# EAGLE design NodeTemplate.cg2 (EAGLE 4.16)
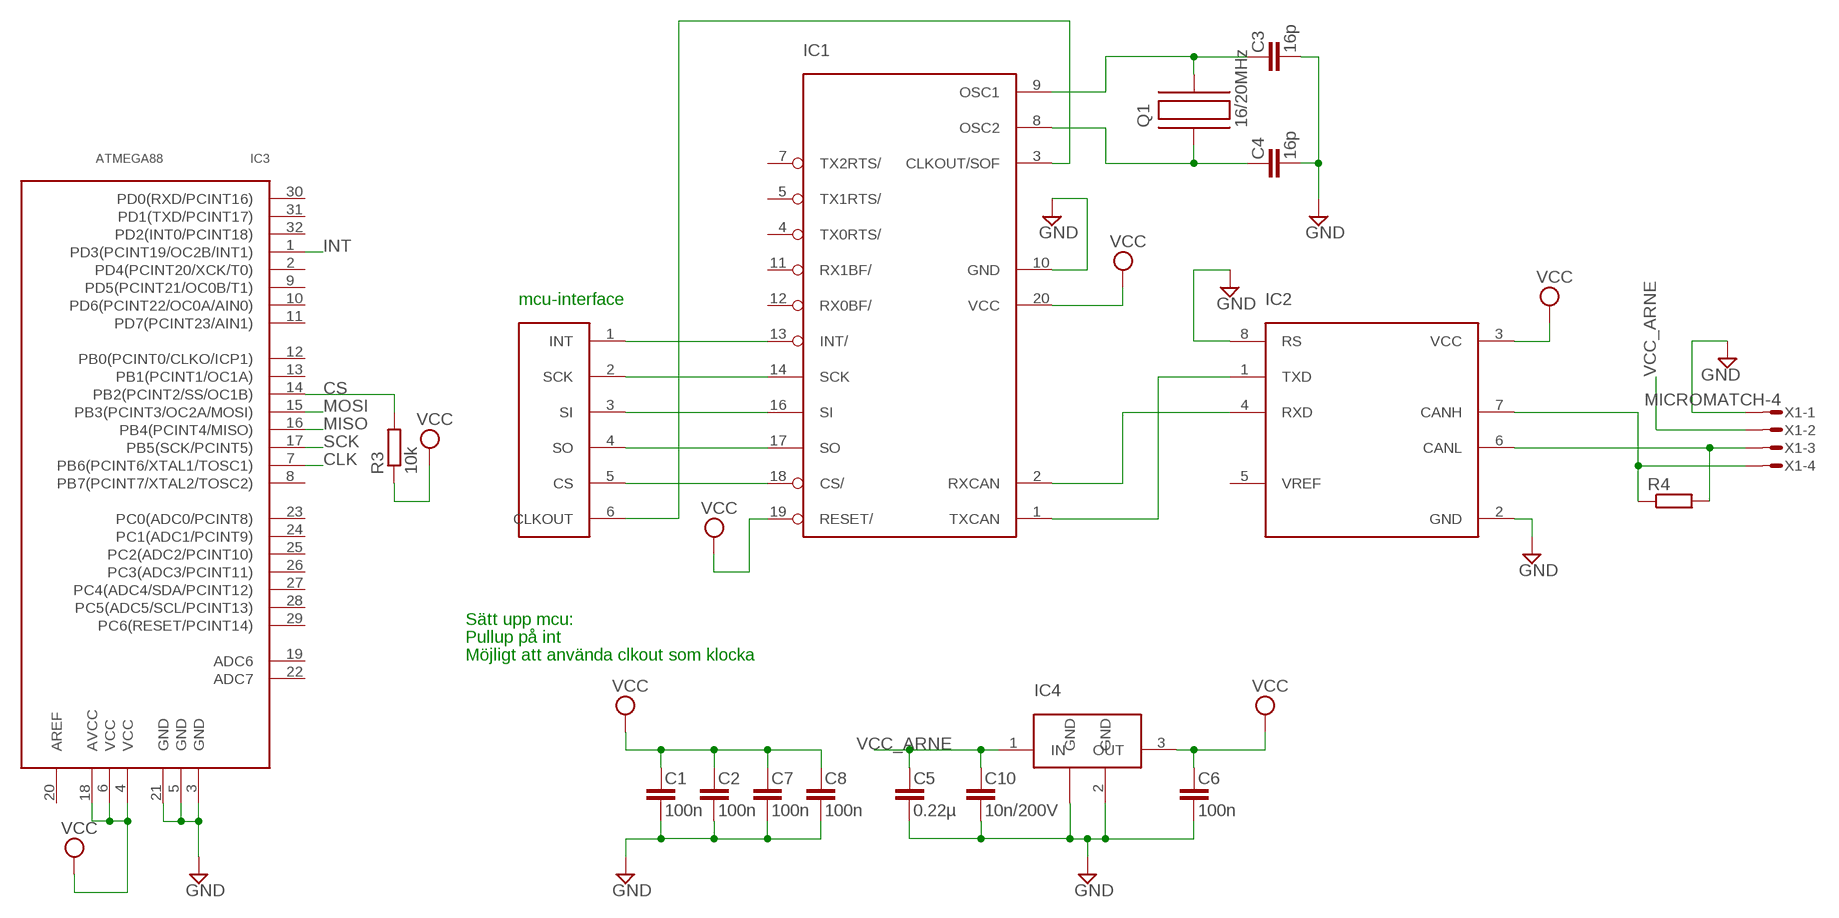
[diagram p0: schematic, sheet 1]

## Parts
C1  100n  C-EU  [C0603]
C2  100n  C-EU  [C0603]
C3  16p  C-EU  [C0603]
C4  16p  C-EU  [C0603]
C5  0.22µ  C-EU  [C0603]
C6  100n  C-EU  [C0603]
C7  100n  C-EU  [C0603]
C8  100n  C-EU  [C0603]
C10  10n/200V  C-EU  [C0603]
IC1  MCP2515  [TSSOP]
IC2  MCP2551  [SOIC]
IC3  ATMEGA88  [TQFP32]
IC4  LM340MP-5.0  [SOT223]
Q1  16/20MHz  C-MAC-LFA147E  [SMD]
R3  10k  R-EUR0603  [R0603]
R4  R-EUR0603  [R0603]
U$1  CAN-INTERFACE  [VIA-LIST]
X1  MICROMATCH-4  [MICROMATCH-4]

## Nets
CANH: IC2.7(CANH) R4.1 X1.4
CANL: IC2.6(CANL) R4.2 X1.3
CLK: IC1.3(CLKOUT/SOF) IC3.7(PB6(PCINT6/XTAL1/TOSC1)) U$1.6(CLKOUT)
CS: IC1.18(CS/) IC3.14(PB2(PCINT2/SS/OC1B)) R3.2 U$1.5(CS)
GND: C1.2 C2.2 C3.2 C4.2 C5.2 C6.2 C7.2 C8.2 C10.2 IC1.10(GND) IC2.2(GND) IC2.8(RS) IC3.3(GND) IC3.5(GND) IC3.21(GND) IC4.2(GND) IC4.4(GND) X1.1
INT: IC1.13(INT/) IC3.1(PD3(PCINT19/OC2B/INT1)) U$1.1(INT)
MISO: IC1.17(SO) IC3.16(PB4(PCINT4/MISO)) U$1.4(SO)
MOSI: IC1.16(SI) IC3.15(PB3(PCINT3/OC2A/MOSI)) U$1.3(SI)
N$1: IC1.2(RXCAN) IC2.4(RXD)
N$2: IC1.1(TXCAN) IC2.1(TXD)
N$12: C3.1 IC1.9(OSC1) Q1.P$2
N$13: C4.1 IC1.8(OSC2) Q1.P$1
SCK: IC1.14(SCK) IC3.17(PB5(SCK/PCINT5)) U$1.2(SCK)
VCC: C1.1 C2.1 C6.1 C7.1 C8.1 IC1.19(RESET/) IC1.20(VCC) IC2.3(VCC) IC3.4(VCC) IC3.6(VCC) IC3.18(AVCC) IC4.3(OUT) R3.1
VCC_ARNE: C5.1 C10.1 IC4.1(IN) X1.2
Unconnected: IC1.4(TX0RTS/) IC1.5(TX1RTS/) IC1.7(TX2RTS/) IC1.11(RX1BF/) IC1.12(RX0BF/) IC2.5(VREF) IC3.2(PD4(PCINT20/XCK/T0)) IC3.8(PB7(PCINT7/XTAL2/TOSC2)) IC3.9(PD5(PCINT21/OC0B/T1)) IC3.10(PD6(PCINT22/OC0A/AIN0)) IC3.11(PD7(PCINT23/AIN1)) IC3.12(PB0(PCINT0/CLKO/ICP1)) IC3.13(PB1(PCINT1/OC1A)) IC3.19(ADC6) IC3.20(AREF) IC3.22(ADC7) IC3.23(PC0(ADC0/PCINT8)) IC3.24(PC1(ADC1/PCINT9)) IC3.25(PC2(ADC2/PCINT10)) IC3.26(PC3(ADC3/PCINT11)) IC3.27(PC4(ADC4/SDA/PCINT12)) IC3.28(PC5(ADC5/SCL/PCINT13)) IC3.29(PC6(RESET/PCINT14)) IC3.30(PD0(RXD/PCINT16)) IC3.31(PD1(TXD/PCINT17)) IC3.32(PD2(INT0/PCINT18))

## Notes on the sheet
- mcu-interface
- Sätt upp mcu:
- Pullup på int
- Möjligt att använda clkout som klocka

## Library data of the parts
C1-C8 C10 = rcl:C-EU
IC1 = mcp2515:MCP2515
IC2 = mcp2551:MCP2551
IC3 = atmega88:ATMEGA88
IC4 = lm340mp:LM340MP-5.0
Q1 = hc49-4h-smx:C-MAC-LFA147E
R3 R4 = rcl:R-EU
U$1 = can-interface:CAN-INTERFACE
X1 = con-amp-micromatch:MICROMATCH-4: MicroMaTch 4 7-215464-4 / 0-215464-4 Drawing Number C-215464 DDEController.pdf

## Board
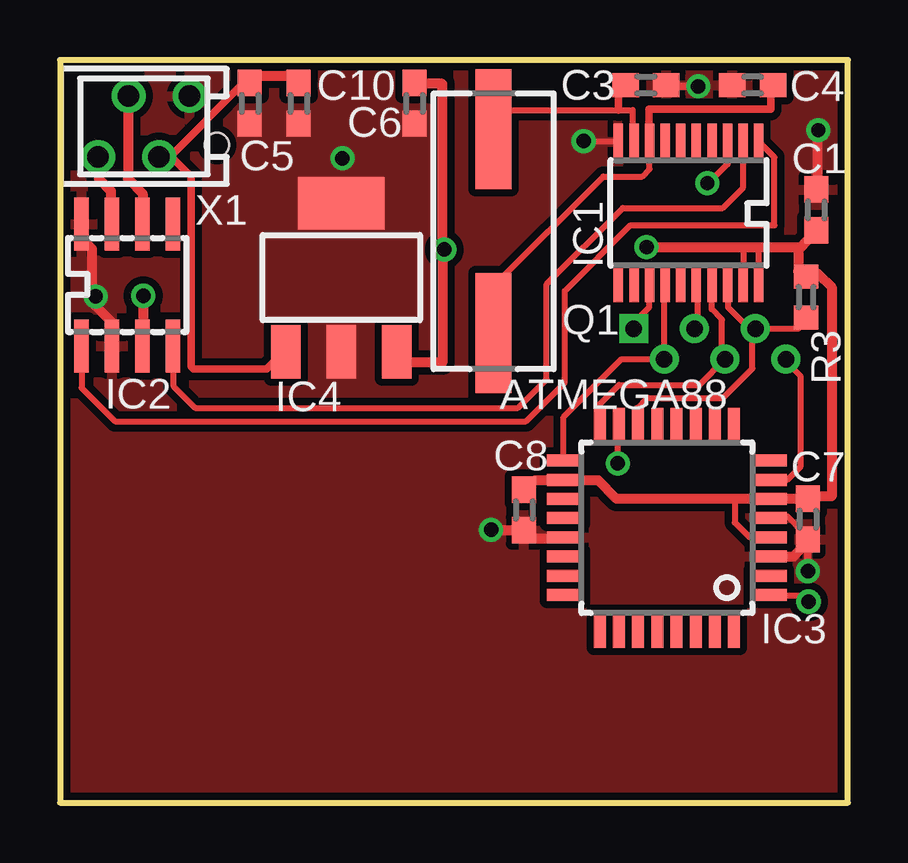
[diagram p1: board, top side]
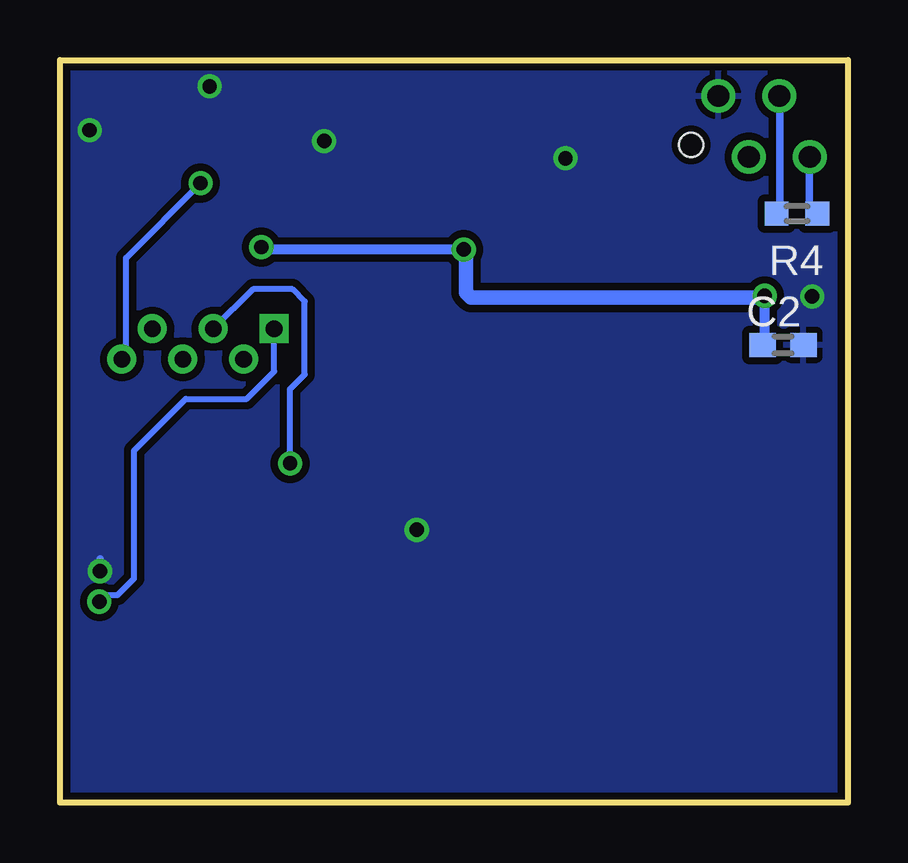
[diagram p2: board, bottom side, seen from below]

Size 32.85 x 30.97 mm. Coordinates in mm from the lower left corner, seen from the top.
Outline: 0,0 32.85,0 32.85,30.97 0,30.97 0,0
Copper layers (1*16): Top 0.035mm / dielectric 1.5mm / Bottom 0.035mm
Design rules "10mils, 0.6drill": minimum track width 10mil, minimum drill 0.6mm, track to track 10mil, track to pad 10mil, pad to pad 10mil, via to via 10mil, smd to smd 10mil, copper to edge 10mil, drill to drill 10mil, minimum pad ring 10mil, minimum via ring 8mil, stop-mask expansion 0mil, vias tented up to drill 0mil, thermal gap 10mil

### Footprints (pad centres in the part's own frame; a part is rotated, then mirrored left to right if it is on the bottom)
C0603 = smd 1.1 x 1: 1 -0.85,0; 2 0.85,0
TSSOP = smd 0.396 x 1.5: 1 -2.925,-2.975; 2 -2.275,-2.975; 3 -1.625,-2.975; 4 -0.975,-2.975; 5 -0.325,-2.975; 6 0.325,-2.975; 7 0.975,-2.975; 8 1.625,-2.975; 9 2.275,-2.975; 10 2.925,-2.975; 11 2.925,2.975; 12 2.275,2.975; 13 1.625,2.975; 14 0.975,2.975; 15 0.325,2.975; 16 -0.325,2.975; 17 -0.975,2.975; 18 -1.625,2.975; 19 -2.275,2.975; 20 -2.925,2.975
SOIC = smd 0.6 x 2.2: 1 -1.905,-2.54; 2 -0.635,-2.54; 3 0.635,-2.54; 4 1.905,-2.54; 5 1.905,2.54; 6 0.635,2.54; 7 -0.635,2.54; 8 -1.905,2.54
TQFP32 = smd 1.5 x 0.5: 1 -4.25,2.65; 2 -4.25,1.85; 3 -4.25,1.05; 4 -4.25,0.25; 5 -4.25,-0.55; 6 -4.25,-1.35; 7 -4.25,-2.15; 8 -4.25,-2.95; 17 4.25,-2.95; 18 4.25,-2.15; 19 4.25,-1.35; 20 4.25,-0.55; 21 4.25,0.25; 22 4.25,1.05; 23 4.25,1.85; 24 4.25,2.65 | smd 0.5 x 1.5: 9 -2.8,-4.4; 10 -2,-4.4; 11 -1.2,-4.4; 12 -0.4,-4.4; 13 0.4,-4.4; 14 1.2,-4.4; 15 2,-4.4; 16 2.8,-4.4; 25 2.8,4.1; 26 2,4.1; 27 1.2,4.1; 28 0.4,4.1; 29 -0.4,4.1; 30 -1.2,4.1; 31 -2,4.1; 32 -2.8,4.1
SOT223 = smd 1.219 x 2.235: 1 -2.311,-3.099; 2 0,-3.099; 3 2.311,-3.099 | smd 3.6 x 2.2: 4 0,3.099
SMD = smd 5 x 1.5: P$1 4.25,0; P$2 -4.25,0
R0603 = smd 0.991 x 1.016: 1 -0.85,0; 2 0.85,0
VIA-LIST = drill 0.7 square: 1 0,2.54 | drill 0.7 round: 2 -1.27,1.27; 3 0,0; 4 -1.27,-1.27; 5 0,-2.54; 6 -1.27,-3.81
MICROMATCH-4 = drill 0.9 round: 1 1.905,1.27; 2 0.635,-1.27; 3 -0.635,1.27; 4 -1.905,-1.27 | hole 1: 3.048,-0.762

### Placement (x,y rotation side)
C1  31.54,24.71 90 top
C2  2.7,19.09 0 bottom
C3  24.43,29.92 0 top
C4  28.87,29.92 180 top
C5  7.92,29.16 270 top
C6  14.77,29.16 270 top
C7  31.17,11.83 270 top
C8  19.34,12.21 270 top
C10  9.95,29.16 270 top
IC1  26.21,24.59 180 top
IC2  2.8,21.59 0 top
IC3  25.3,11.32 180 top
IC4  11.73,21.89 0 top
Q1  18.08,23.83 270 top
R3  31.11,21.08 270 top
R4  2.12,24.56 180 bottom
U$1  26.46,19.76 90 top
X1  3.5,28.19 0 top

### Tracks (layer width: path | path; a pad name or v marks a point on that pad's centre or on a via)
CANH
  Top 0.305: 2.12,24.17 IC2.7 | X1.4 1.62,26.92
  Top 0.406: 2.12,24.17 2.12,25.5 1.62,26.01 1.62,26.92
  Bottom 0.305: X1.4 1.62,26.92 1.62,24.91 R4.1
CANL
  Top 0.305: IC2.6 | X1.3 2.84,29.46
  Top 0.406: IC2.6 3.45,25.4 2.84,26.01 2.84,29.46
  Bottom 0.305: X1.3 2.84,29.46 2.84,24.7 R4.2
CLK  (via drill 0.6)
  Top 0.254: IC1.3 27.83,27.46 27.83,26.62 27.02,25.81 v26.99,25.83 | IC3.7 30.32,13.47 30.88,14.02 30.88,17.78 30.22,18.44 30.17,18.49
  Top 0.406: 30.17,18.39 30.22,18.44 U$1.6
  Bottom 0.254: v26.99,25.83 30.09,22.71 30.09,18.64 U$1.6
CS
  Top 0.254: IC1.18 27.83,21.74 27.86,21.74 27.86,20.65 28.87,19.63 | IC3.14 24.07,15.85 | 24.07,15.85 24.07,15.86 | 28.87,19.63 28.87,18.11 27.63,16.87 24.48,16.87 24.07,16.46 24.07,16.05 24.17,15.34 24.07,15.85 | 28.87,19.63 U$1.5 30.78,19.76 31.03,20.02 31.03,20.22 30.97,20.22 R3.2
GND  (via drill 0.6)
  Top 0.254: v21.84,27.59 23.28,27.59 IC1.10 | C1.2 31.59,25.88 | 1.34,20.85 v1.49,21.11 | 20.56,11.02 IC3.21 21.28,11.05 | C8.2 19.8,11.02 | C7.2 31.11,11.3 30.93,11.3 30.32,11.94 29.76,11.89 29.74,11.87 IC3.5 | v31.61,28.04 31.44,27.99 31.59,27.84
  Top 0.305: IC2.2 2.2,19.38 | C3.2 25.45,29.87 v26.61,29.87 | 30.93,11.3 31.16,11.3 31.18,11.28 31.18,10.77 v31.18,9.65
  Top 0.406: 2.2,19.38 2.2,19.99 1.34,20.85 1.34,23.09 0.83,23.6 IC2.8 | 19.8,11.02 20.56,11.02 | 31.59,25.88 31.59,27.84 | 31.18,10.77 31.08,10.77 30.58,10.27 IC3.3 | C8.2 18,11.36 v17.97,11.38
  Bottom 0.305: v26.61,29.87 26.56,29.95 | v31.18,9.65 31.18,10.16
  Bottom 0.406: v17.97,11.38 18.08,11.38
  other vias: 11.78,26.87
  pour Bottom (isolate 0.305): 0.12,30.86 32.83,30.86 32.83,0.1 24.38,0.1 0.12,0.1
  pour Top (isolate 0.305, no thermals): 5.83,30.5 15.89,30.5 15.89,16.78 5.83,16.78
  pour Top (isolate 0.305): 0.17,30.81 32.68,30.81 32.68,0.08 0.17,0.08
INT  (via drill 0.6)
  Top 0.254: IC1.13 | IC1.13 | U$1.1 23.92,20.02 24.55,20.65 24.55,21.59 IC1.13 | IC3.1 29.48,8.67 29.46,8.64 30.01,8.69 30.07,8.64 30.95,8.64 v31.21,8.38
  Bottom 0.254: v31.21,8.38 30.9,8.66 30.45,8.66 29.76,9.35 29.76,14.68 27.6,16.84 25.06,16.84 23.92,17.98 U$1.1
MISO
  Top 0.254: IC1.17 27.18,21.68 27.17,21.67 27.17,20.57 27.6,20.14 27.6,18.75 27.73,18.62 U$1.4 26.66,17.42 23.31,17.42 22.45,16.56 22.45,15.24 22.44,15.23 22.41,15.23 | IC3.16 22.41,15.23 | 22.41,15.23 22.39,15.3
MOSI  (via drill 0.6)
  Top 0.254: IC1.16 26.53,21.74 26.51,21.72 26.51,21.49 26.58,21.41 26.58,19.89 U$1.3 | IC3.15 23.3,15.69 23.26,15.65 v23.26,14.15
  Bottom 0.254: U$1.3 26.51,19.81 | U$1.3 26.41,19.71 | v23.26,14.15 23.26,17.25 22.65,17.86 22.65,20.91 23.16,21.41 24.81,21.41 U$1.3
N$1
  Top 0.254: 4.77,19 4.75,19 IC2.4 4.71,19.03 4.74,19 4.74,17.35 5.63,16.46 19.09,16.46 20.29,17.65 20.29,21.62 23.46,24.79 27.63,24.79 28.48,25.65 IC1.2
N$2
  Top 0.254: IC1.1 29.79,26.91 29.79,24.08 23.79,24.08 21.05,21.34 21.05,17.53 19.42,15.9 2.3,15.9 0.91,17.3 IC2.1 | IC2.1 0.91,19.1 | IC2.1
N$12
  Top 0.254: IC1.9 23.87,27.91 23.87,28.88 23.28,28.88 18.13,28.88 Q1.P$2
  Top 0.305: C3.1 23.28,29.45 23.28,28.88
N$13
  Top 0.254: Q1.P$1 18.14,21.61 22.65,26.11 24.27,26.11 24.58,26.42 24.58,27.33 24.55,27.36 24.55,27.44
  Top 0.305: IC1.8 24.55,27.44 24.55,28.91 29.63,28.91 29.63,29.96 C4.1
SCK
  Top 0.254: IC1.14 25.23,21.71 25.19,21.67 IC1.14 25.19,21.62 U$1.2 23.41,18.49 21,16.08 21,14.2 IC3.17
VCC  (via drill 0.6)
  Top 0.254: 29.81,12.67 IC3.6 29.05,12.67 | 21.28,13.44 IC3.18 | IC1.20 29.12,21.74 29.12,23.17 29.68,23.17 | IC1.19 28.48,21.68 28.49,21.67 28.49,23.17 28.49,23.19 | 30.57,23.22 30.78,23.22 30.9,23.19 | IC3.4 28.75,11.07 28.13,11.69 28.13,12.67
  Top 0.406: 15.95,23.06 15.95,18.35 14.08,18.35 14.08,19.05 IC4.3 | IC2.3 3.42,19.43 3.47,19.91 v3.47,21.13 | 15.95,23.06 15.95,29.98 14.83,29.98 14.77,29.92 C6.1 | v16.02,23.06 15.95,23.06 | v24.45,23.17 28.49,23.17 29.68,23.17 | 29.68,23.17 29.68,23.16 | IC3.18 20.56,13.44 19.8,13.44 C8.1 | 29.81,12.67 30.7,12.67 C7.1 31.41,12.78 32.17,12.78 32.17,21.49 31.61,22.05 30.88,22.05 | 21.28,13.44 22.45,13.44 23.21,12.67 28.13,12.67 29.05,12.67 | 29.68,23.17 30.78,23.17 | 30.78,23.17 30.9,23.17 30.9,23.19 C1.1 | 30.88,22.05 30.88,21.96 R3.1 | 30.88,22.05 30.78,22.15 30.78,23.17
  Bottom 0.254: C2.1 3.47,19.58
  Bottom 0.406: 3.47,19.58 3.47,21.06 v3.47,21.13 | v24.45,23.17 24.4,23.17 24.3,23.06 v16.02,23.06
  Bottom 0.61: 3.47,21.06 15.71,21.06 15.92,21.26 15.92,23.06 v16.02,23.06
VCC_ARNE
  Top 0.254: 7.88,29.97 C5.1
  Top 0.305: IC4.1 9.31,18.79 8.61,18.09 5.58,18.09 5.48,18.19 5.48,26.11 4.67,26.92 4.26,26.92 | 7.88,29.97 7.61,29.97 4.56,26.92 4.26,26.92 | 4.26,26.92 X1.2
  Top 0.406: C10.1 9.95,30.3 7.92,30.3 C5.1